# Altium schematic sheet etapa2.SchDoc
size Letter
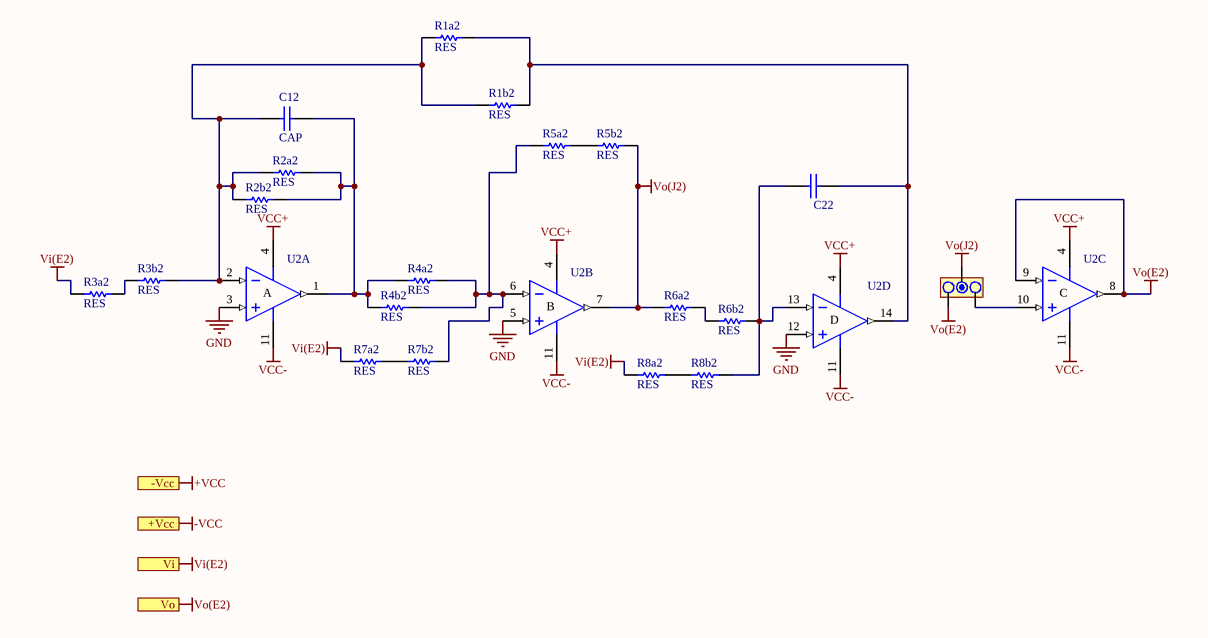
[diagram p0: etapa2.SchDoc]

## Parts
C12  CAP  [CAP200]
C22  CAP  [CAP200]  (value not drawn)
Jumper2  JUMPER  [JUMPER3]  (value not drawn)
R1a2  RES  [0805]
R1b2  RES  [0805]
R2a2  RES  [0805]
R2b2  RES  [0805]
R3a2  RES  [0805]
R3b2  RES  [0805]
R4a2  RES  [0805]
R4b2  RES  [0805]
R5a2  RES  [0805]
R5b2  RES  [0805]
R6a2  RES  [0805]
R6b2  RES  [0805]
R7a2  RES  [0805]
R7b2  RES  [0805]
R8a2  RES  [0805]
R8b2  RES  [0805]
U2  TL084N  [N014]  (value not drawn)  (parts A,B,C,D of 4)

## Ports
+Vcc, -Vcc, Vi, Vo

## Nets
+VCC: port -Vcc
-VCC: port +Vcc
GND: U2.3(IN+) U2.5(IN+) U2.12(IN+)
VCC+: U2.4(V+)
VCC-: U2.11(V-)
Vi(E2): R3a2.1 R7a2.1 R8a2.1 ; port Vi
Vo(E2): Jumper2.3 U2.8(OUT) U2.9(IN-) ; port Vo
Vo(J2): Jumper2.2 R5b2.2 R6a2.1 U2.7(OUT)
NetC12_1: C12.1 R1a2.1 R1b2.1 R2a2.1 R2b2.1 R3b2.2 U2.2(IN-)
NetC12_2: C12.2 R2a2.2 R2b2.2 R4a2.1 R4b2.1 U2.1(OUT)
NetC22_1: C22.1 R6b2.2 R8b2.2 U2.13(IN-)
NetC22_2: C22.2 R1a2.2 R1b2.2 U2.14(OUT)
NetJumper2_1: Jumper2.1 U2.10(IN+)
NetR3a2_2: R3a2.2 R3b2.1
NetR4a2_2: R4a2.2 R4b2.2 R5a2.1 R7b2.2 U2.6(IN-)
NetR5a2_2: R5a2.2 R5b2.1
NetR6a2_2: R6a2.2 R6b2.1
NetR7a2_2: R7a2.2 R7b2.1
NetR8a2_2: R8a2.2 R8b2.1

## Notes on the sheet
- (in symbol TL084N, part A) A
- (in symbol TL084N, part B) B
- (in symbol TL084N, part C) C
- (in symbol TL084N, part D) D

## Library data of the parts
Jumper2 = JUMPER3
U2 = TL084N: JFET-Input Operational Amplifier; Published: 16-Jan-2001; LatestRevisionDate: 04-Mar-2005; LatestRevisionNote: Stylized 3D Model Added.; DatasheetVersion: Feb-1999; PackageVersion: Oct-1995; PackageReference: N014; Publisher: Altium Limited; PackageDescription: DIP; 14 Leads; Row Spacing 7.62 mm; Pitch 2.54 mm; ComponentLink1Description: Manufacturer Link; ComponentLink1URL: http://www.ti.com/; ComponentLink2Description: Datasheet; ComponentLink2URL: http://www-s.ti.com/sc/ds/tl084.pdf